# Altium schematic sheet 08_Zynq Config_ADC.SchDoc
size A3; SheetNumber: 8; SheetTotal: 14
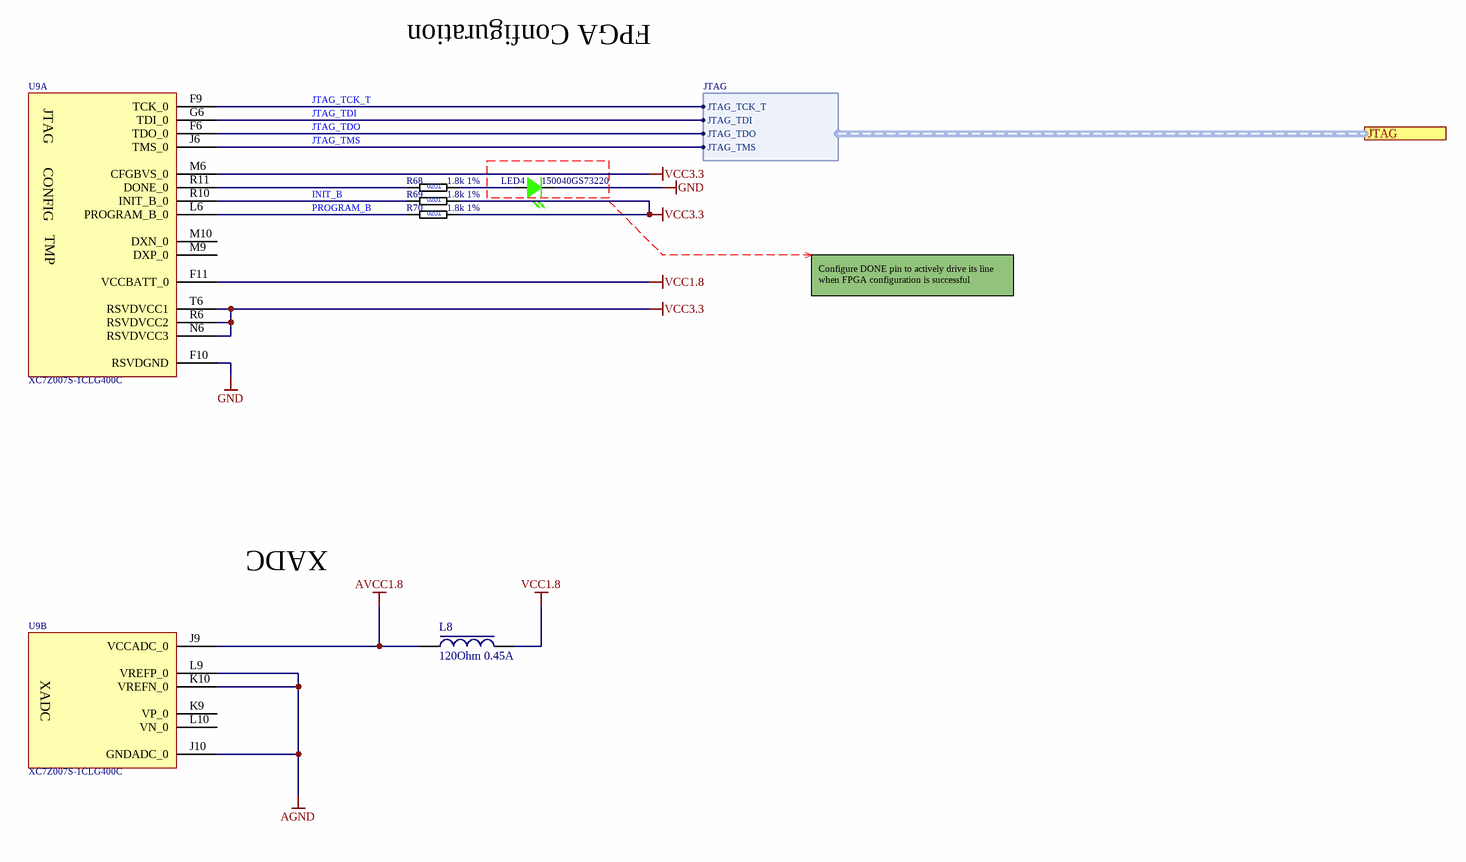
[diagram p0: 08_Zynq Config_ADC.SchDoc]

## Parts
L8  120Ohm 0.45A  [INDC0603X03L]
LED4  150040GS73220  [WL-SMCC_0402_H=0.25mm]
R68  1.8k 1%  [RESC0603X03L]
R69  1.8k 1%  [RESC0603X03L]
R70  1.8k 1%  [RESC0603X03L]
U9  XC7Z007S-1CLG400C  [BGA400C80P20X20_1700X1700X160]  (parts A,B of 8)

## Ports
JTAG (harness JTAG)

## Harnesses
JTAG: JTAG_TMS, JTAG_TDO, JTAG_TDI, JTAG_TCK_T

## Nets
AGND: U9.J10(GNDADC_0) U9.K10(VREFN_0) U9.L9(VREFP_0)
AVCC1.8: L8.2 U9.J9(VCCADC_0)
GND: LED4.1 U9.F10(RSVDGND)
VCC1.8: L8.1 U9.F11(VCCBATT_0)
VCC3.3: R69.2 R70.2 U9.M6(CFGBVS_0) U9.N6(RSVDVCC3) U9.R6(RSVDVCC2) U9.T6(RSVDVCC1)
INIT_B: R69.1 U9.R10(INIT_B_0)
JTAG_TCK_T: U9.F9(TCK_0) ; port JTAG.JTAG_TCK_T
JTAG_TDI: U9.G6(TDI_0) ; port JTAG.JTAG_TDI
JTAG_TDO: U9.F6(TDO_0) ; port JTAG.JTAG_TDO
JTAG_TMS: U9.J6(TMS_0) ; port JTAG.JTAG_TMS
PROGRAM_B: R70.1 U9.L6(PROGRAM_B_0)
NetLED4_2: LED4.2 R68.2
NetR68_1: R68.1 U9.R11(DONE_0)

Not connected (* = marked no-connect by the designer): U9 K9(VP_0) L10(VN_0) M9(DXP_0) M10(DXN_0)

## Notes on the sheet
- FPGA Configuration
- Configure DONE pin to actively drive its line when FPGA configuration is successful
- XADC
- Title:
- ++CONFIDENTIAL++
- Datum:
- Blatt:
- von:
- Zeit:
- Entwickler:
- Der transparenteste Entwicklungsdienstleister
  der Elektronik- und Softwareentwicklung
- The  information  contained  in  these  documents  is  confidential,  privileged  and  only  for  the
  information of the intended recipient and may
  not be used, published or redistributed without
  the prior written consent from PCB Arts GmbH.
- Revision:
- Checked:
- https://pcb-arts.com/
- mail@pcb-arts.com
- (in symbol RES_0201_1.8k_1%) 0201
- (in symbol XC7Z007S-1CLG400C_Processors - Application Specialised, part A) JTAG; CONFIG; TMP
- (in symbol XC7Z007S-1CLG400C_Processors - Application Specialised, part B) XADC

## Library data of the parts
L8 = FLT_0201_120Ohm_0.45A: Ferrite Bead 0201 120Ohm 0.45A 25%; Manufacturer Prt. Nr.: BK0603HR121-T; Manufacturer: Taiyo Yuden
LED4 = 150040GS73220_SMD WL-SMCC SMT LED Mono-color: Standard LEDs - SMD WL-SMCC SMT LED Mono-color; Manufacturer 1: Wurth Elektronik; Manufacturer 1 Prt. Nr.: 150040GS73220
R68-R70 = RES_0201_1.8k_1%: Thick Film Resistors - SMD 1.8K OHM 1%; Manufacturer 1: Panasonic; Manufacturer 1 Prt. Nr.: ERJ-1GNF1801C; Manufacturer 2 Prt. Nr.: CRCW02011K80FKED; Manufacturer 2: Vishay / Dale
U9 = XC7Z007S-1CLG400C_Processors - Application Specialised: Manufacturer 1: Xilinx; Manufacturer 1 Prt. Nr.: XC7Z007S-1CLG400C